# Altium schematic sheet cpu.SchDoc
size A4
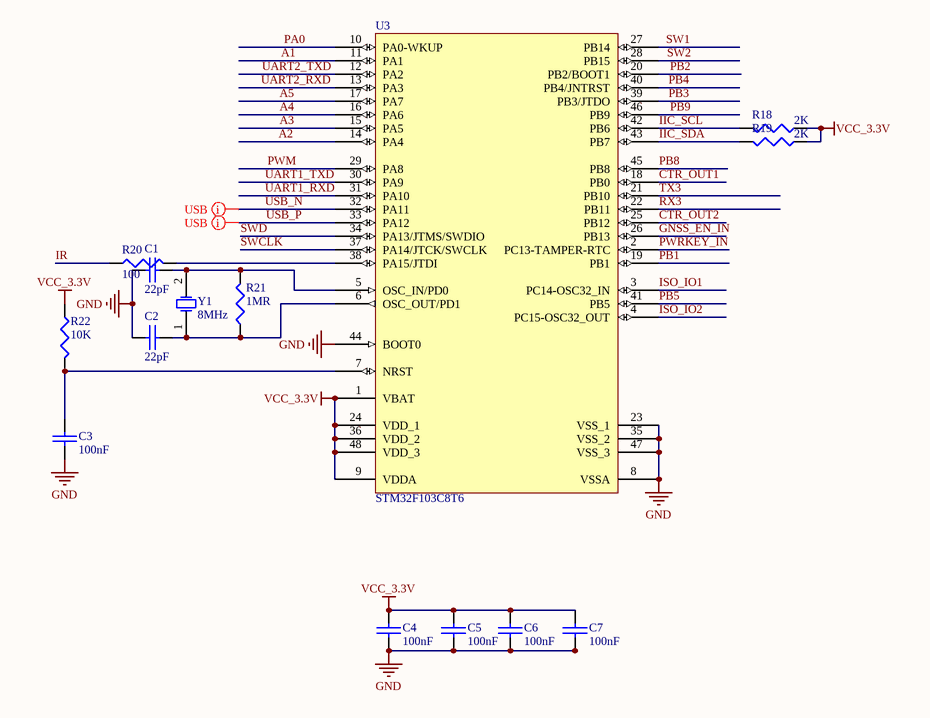
[diagram p0: cpu.SchDoc]

## Parts
C1  22pF  [0402C]
C2  22pF  [0402C]
C3  100nF  [0402C]
C4  100nF  [0402C]
C5  100nF  [0402C]
C6  100nF  [0402C]
C7  100nF  [0402C]
R18  2K  [0402R]
R19  2K  [0402R]
R20  100  [0402R]
R21  1MR  [0402R]
R22  10K  [0402R]
U3  STM32F103C8T6  [TQFP-48]
Y1  8MHz  [CRAY_5032]

## Nets
GND: C1.1 C2.1 C3.1 C4.1 C5.1 C6.1 C7.1 U3.8(VSSA) U3.23(VSS_1) U3.35(VSS_2) U3.44(BOOT0) U3.47(VSS_3)
VCC_3.3V: C4.2 C5.2 C6.2 C7.2 R18.1 R19.1 R22.1 U3.1(VBAT) U3.9(VDDA) U3.24(VDD_1) U3.36(VDD_2) U3.48(VDD_3)
A1: U3.11(PA1)
A2: U3.14(PA4)
A3: U3.15(PA5)
A4: U3.16(PA6)
A5: U3.17(PA7)
CTR_OUT1: U3.18(PB0)
CTR_OUT2: U3.25(PB12)
GNSS_EN_IN: U3.26(PB13)
IIC_SCL: R18.2 U3.42(PB6)
IIC_SDA: R19.2 U3.43(PB7)
IR: R20.1
ISO_IO1: U3.3(PC14-OSC32_IN)
ISO_IO2: U3.4(PC15-OSC32_OUT)
PA0: U3.10(PA0-WKUP)
PB1: U3.19(PB1)
PB2: U3.20(PB2/BOOT1)
PB3: U3.39(PB3/JTDO)
PB4: U3.40(PB4/JNTRST)
PB5: U3.41(PB5)
PB8: U3.45(PB8)
PB9: U3.46(PB9)
PWM: U3.29(PA8)
PWRKEY_IN: U3.2(PC13-TAMPER-RTC)
RX3: U3.22(PB11)
SW1: U3.27(PB14)
SW2: U3.28(PB15)
SWCLK: U3.37(PA14/JTCK/SWCLK)
SWD: U3.34(PA13/JTMS/SWDIO)
TX3: U3.21(PB10)
UART1_RXD: U3.31(PA10)
UART1_TXD: U3.30(PA9)
UART2_RXD: U3.13(PA3)
UART2_TXD: U3.12(PA2)
USB_N: U3.32(PA11)
USB_P: U3.33(PA12)
NetC1_2: C1.2 R21.2 U3.5(OSC_IN/PD0) Y1.2(OSC2)
NetC2_2: C2.2 R21.1 U3.6(OSC_OUT/PD1) Y1.1(OSC1)
NetC3_2: C3.2 R22.2 U3.7(NRST)
NetR20_2: R20.2 U3.38(PA15/JTDI)

## Layout directives
differential pair: USB_N, USB_P

## Library data of the parts
C1-C7 = CAP: Capacitor
R18-R22 = Res3: Resistor; Published: 8-Jun-2000; LatestRevisionDate: 29-May-2009; LatestRevisionNote: IPC-7351 Footprint Added.; PackageReference: J1-0603; Publisher: Altium Limited; PackageDescription: Chip Resistor
U3 = STM32F103C8T6: STM32 ARM-based 32-bit MCU with 64 Kbytes Flash, 48-pin LQFP, Industrial Temperature; Published: 30-May-2008; DatasheetVersion: rev6, Mar-2008; PackageVersion: Mar-2008; PackageReference: LQFP48; Publisher: Altium Limited; PackageDescription: 48-Pin Low-Profile Quad Flat Pack, 7 x 7 mm Body, 0.5 mm Pitch (LQFP48); ComponentLink1Description: Manufacturer Link; ComponentLink1URL: www.st.com/stm32; ComponentLink2Description: Datasheet; ComponentLink2URL: http://www.st.com/stonline/products/literature/ds/13587.pdf
Y1 = XTAL: Crystal Oscillator; Published: 8-Jun-2000; LatestRevisionDate: 17-Jul-2002; LatestRevisionNote: Re-released for DXP Platform.; PackageReference: R38; Publisher: Altium Limited; PackageDescription: Crystal, Thru-Hole; 2 Leads; Body 3.1 x 8.2 mm (Dia.xH)